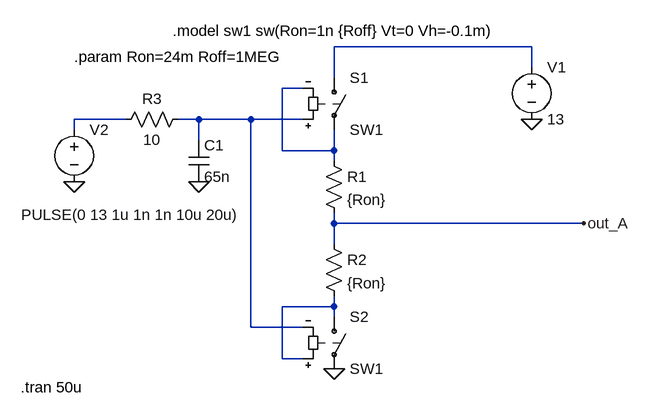
[diagram p0: schematic Half_Bridge.asc]
Half_Bridge.asc, the LTspice schematic file:
Version 4
SHEET 1 880 680
WIRE -368 160 -368 144
WIRE -288 144 -368 144
WIRE -176 144 -208 144
WIRE -176 176 -176 144
WIRE -96 144 -176 144
WIRE -96 464 -96 144
WIRE -48 192 -48 96
WIRE -48 512 -48 432
WIRE -16 96 -48 96
WIRE -16 144 -96 144
WIRE -16 464 -96 464
WIRE -16 512 -48 512
WIRE 32 80 32 32
WIRE 32 192 -48 192
WIRE 32 192 32 160
WIRE 32 208 32 192
WIRE 32 304 32 288
WIRE 32 336 32 304
WIRE 32 432 -48 432
WIRE 32 432 32 416
WIRE 32 448 32 432
WIRE 336 32 32 32
WIRE 336 64 336 32
WIRE 416 304 32 304
FLAG 336 144 0
FLAG 32 528 0
FLAG 416 304 out_A
FLAG -176 240 0
FLAG -368 240 0
SYMBOL sw 32 64 R0
SYMATTR InstName S1
SYMATTR Value SW1
SYMBOL voltage 336 48 R0
WINDOW 123 0 0 Left 0
WINDOW 39 0 0 Left 0
SYMATTR InstName V1
SYMATTR Value 13
SYMBOL res 16 192 R0
SYMATTR InstName R1
SYMATTR Value {Ron}
SYMBOL sw 32 432 R0
SYMATTR InstName S2
SYMATTR Value SW1
SYMBOL res 16 320 R0
SYMATTR InstName R2
SYMATTR Value {Ron}
SYMBOL cap -192 176 R0
SYMATTR InstName C1
SYMATTR Value 65n
SYMBOL res -304 160 R270
WINDOW 0 32 56 VTop 0
WINDOW 3 0 56 VBottom 0
SYMATTR InstName R3
SYMATTR Value 10
SYMBOL voltage -368 144 R0
WINDOW 3 -81 147 Left 0
WINDOW 123 0 0 Left 0
WINDOW 39 0 0 Left 0
SYMATTR Value PULSE(0 13 1u 1n 1n 10u 20u)
SYMATTR InstName V2
TEXT -368 48 Left 0 !.param Ron=24m Roff=1MEG
TEXT -216 8 Left 0 !.model sw1 sw(Ron=1n {Roff} Vt=0 Vh=-0.1m)
TEXT -450 556 Left 0 !.tran 50u

The netlist it stands for:
* Half_Bridge.asc
S1 N005 N003 N002 N003 SW1
V1 N005 0 13
R1 N003 out_A {Ron}
S2 N004 0 N004 N002 SW1
R2 out_A N004 {Ron}
C1 N002 0 65n
R3 N001 N002 10
V2 N001 0 PULSE(0 13 1u 1n 1n 10u 20u)
.param Ron=24m Roff=1MEG
.model sw1 sw(Ron=1n {Roff} Vt=0 Vh=-0.1m)
.tran 50u
.backanno
.end